# Altium schematic sheet 07cpu_sdcard.SchDoc
size B
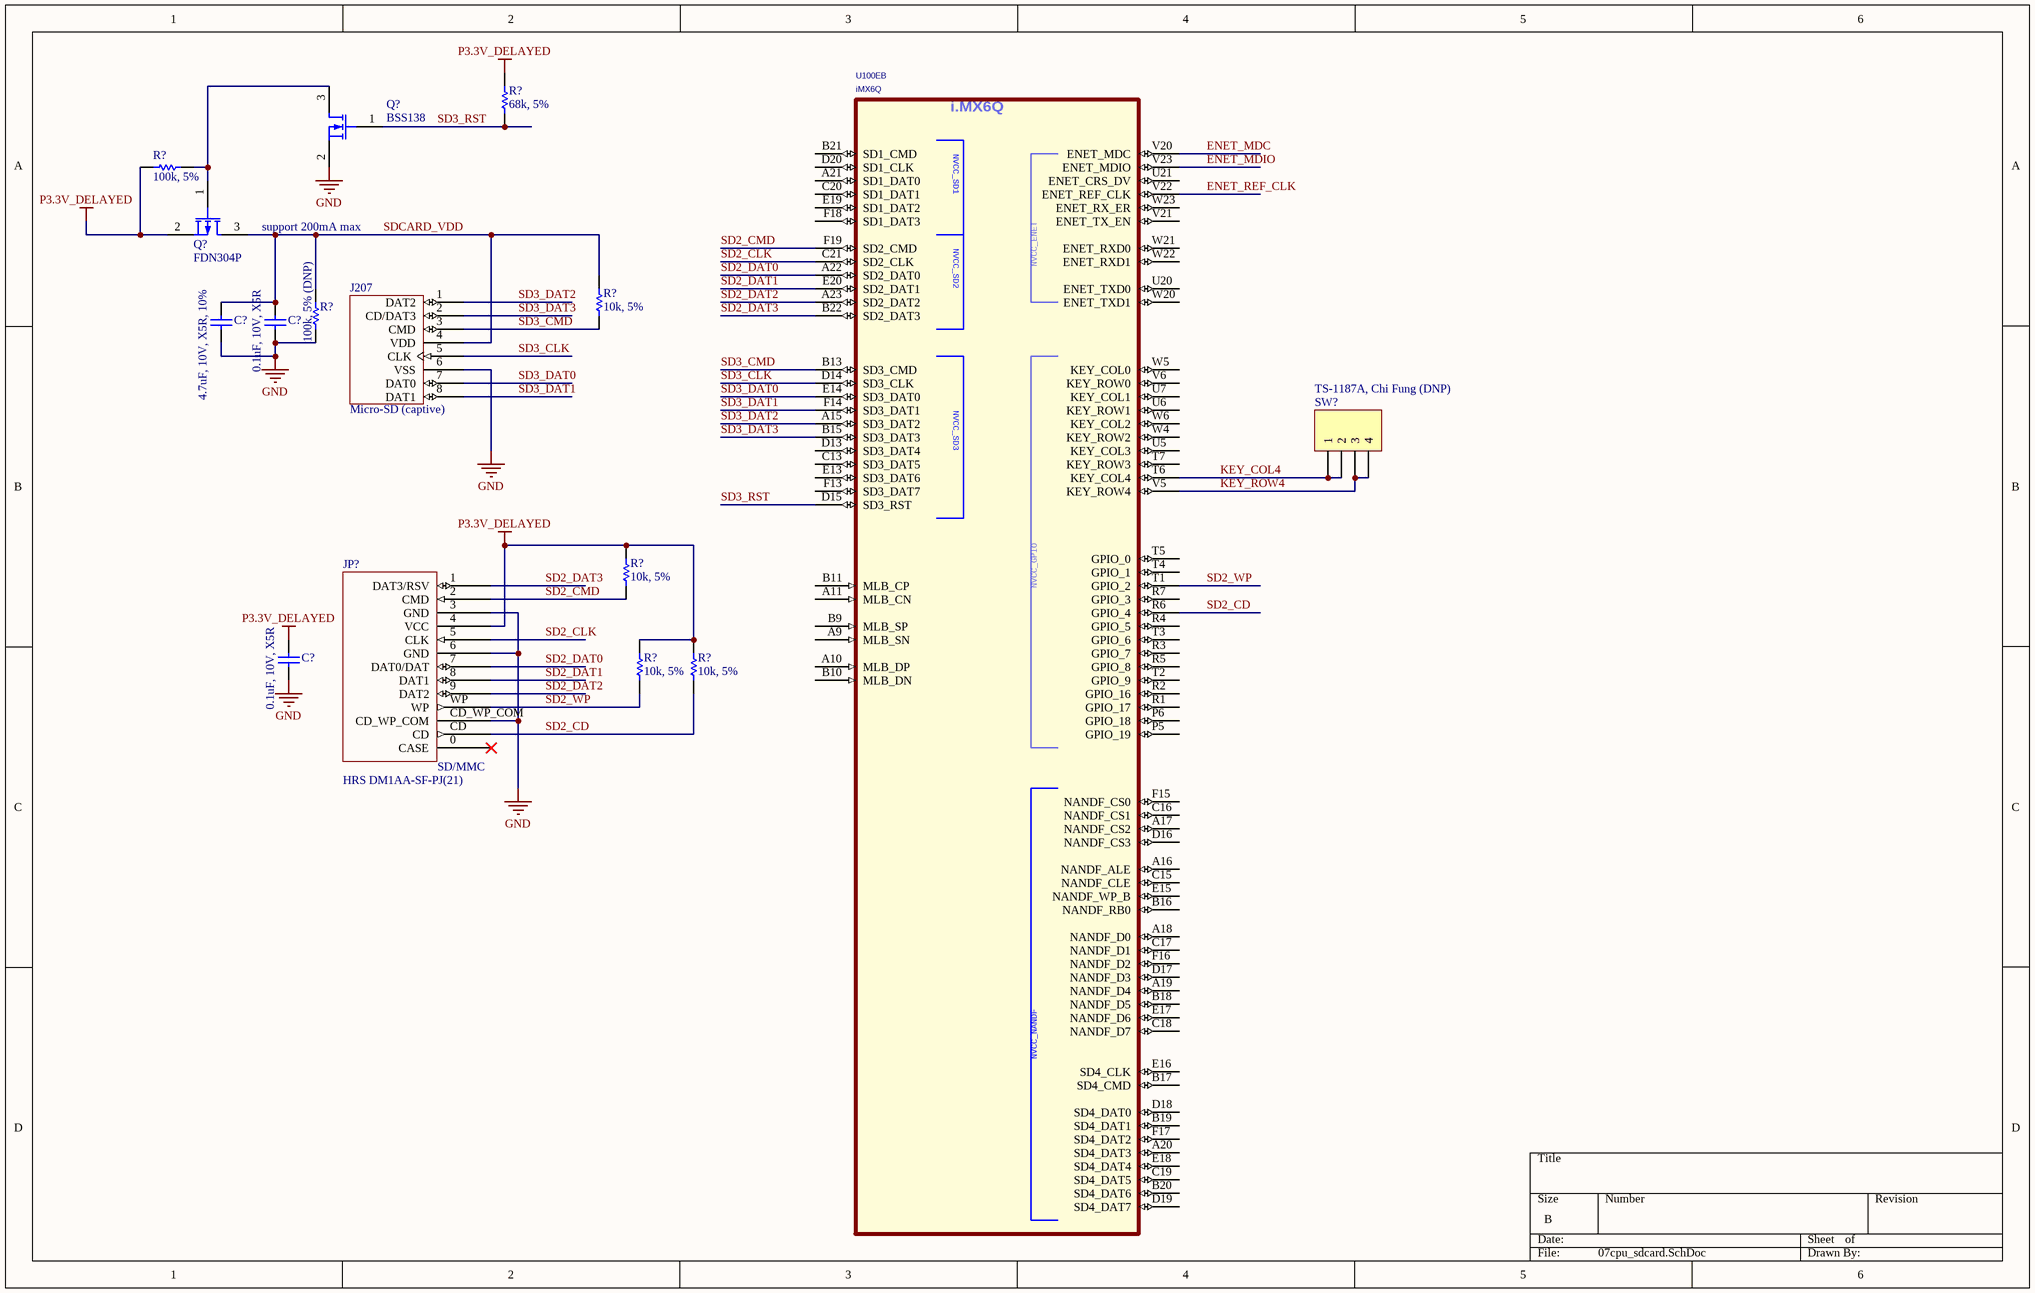
[diagram p0: 07cpu_sdcard.SchDoc]

## Parts
(Parts that share a designator on the sheet are numbered #1, #2 ... from top to bottom, then left to right.)
C?#1  4.7uF, 10V, X5R, 10%  [CAPC1608N]
C?#2  0.1uF, 10V, X5R  [CAPC1005N]
C?#3  0.1uF, 10V, X5R  [CAPC1005N]
J207  Micro-SD (captive)  [AUK_TFC08W01-HC-H]
JP?  HRS DM1AA-SF-PJ(21)  [HRS_DM1AA_SF_PEJ(21)]
Q?#1  BSS138  [SOT23-3N]
Q?#2  FDN304P  [SOT23-3N]
R?#1  68k, 5%  [RESC1005N]
R?#2  100k, 5%  [RESC1005N]
R?#3  10k, 5%  [RESC1005N]
R?#4  100k, 5% (DNP)  [RESC1005N]
R?#5  10k, 5%  [RESC1005N]
R?#6  10k, 5%  [RESC1005N]
R?#7  10k, 5%  [RESC1005N]
SW?  TS-1187A, Chi Fung (DNP)  [SWITCH_TS-1187A]
U100E  iMX6Q  [FREESCALE_BGA624C80P25X25_2100X2100X216]  (part B of 12)

## Nets
GND: C?#1.2 C?#2.2 C?#3.2 J207.6(VSS) JP?.3(GND) JP?.6(GND) JP?.CD_WP_COM Q?#1.2(S) R?#4.2
P3.3V_DELAYED: C?#3.1 JP?.4(VCC) Q?#2.2(S) R?#1.1 R?#2.2 R?#5.1 R?#6.1 R?#7.1
ENET_MDC: U100E.V20(ENET_MDC)
ENET_MDIO: U100E.V23(ENET_MDIO)
ENET_REF_CLK: U100E.V22(ENET_REF_CLK)
KEY_COL4: SW?.1 SW?.2 U100E.T6(KEY_COL4)
KEY_ROW4: SW?.3 SW?.4 U100E.V5(KEY_ROW4)
SD2_CD: JP?.CD R?#7.2 U100E.R6(GPIO_4)
SD2_CLK: JP?.5(CLK) U100E.C21(SD2_CLK)
SD2_CMD: JP?.2(CMD) R?#5.2 U100E.F19(SD2_CMD)
SD2_DAT0: JP?.7(DAT0/DAT) U100E.A22(SD2_DAT0)
SD2_DAT1: JP?.8(DAT1) U100E.E20(SD2_DAT1)
SD2_DAT2: JP?.9(DAT2) U100E.A23(SD2_DAT2)
SD2_DAT3: JP?.1(DAT3/RSV) U100E.B22(SD2_DAT3)
SD2_WP: JP?.WP R?#6.2 U100E.T1(GPIO_2)
SD3_CLK: J207.5(CLK) U100E.D14(SD3_CLK)
SD3_CMD: J207.3(CMD) R?#3.2 U100E.B13(SD3_CMD)
SD3_DAT0: J207.7(DAT0) U100E.E14(SD3_DAT0)
SD3_DAT1: J207.8(DAT1) U100E.F14(SD3_DAT1)
SD3_DAT2: J207.1(DAT2) U100E.A15(SD3_DAT2)
SD3_DAT3: J207.2(CD/DAT3) U100E.B15(SD3_DAT3)
SD3_RST: Q?#1.1(G) R?#1.2 U100E.D15(SD3_RST)
SDCARD_VDD: C?#1.1 C?#2.1 J207.4(VDD) Q?#2.3(D) R?#3.1 R?#4.1
NetQ?#1_3: Q?#1.3(D) Q?#2.1(G) R?#2.1

Not connected (* = marked no-connect by the designer): JP? 0(CASE)*; U100E A9(MLB_SN) A10(MLB_DP) A11(MLB_CN) A16(NANDF_ALE) A17(NANDF_CS2) A18(NANDF_D0) A19(NANDF_D4) A20(SD4_DAT3) A21(SD1_DAT0) B9(MLB_SP) B10(MLB_DN) B11(MLB_CP) B16(NANDF_RB0) B17(SD4_CMD) B18(NANDF_D5) B19(SD4_DAT1) B20(SD4_DAT6) B21(SD1_CMD) C13(SD3_DAT5) C15(NANDF_CLE) C16(NANDF_CS1) C17(NANDF_D1) C18(NANDF_D7) C19(SD4_DAT5) C20(SD1_DAT1) D13(SD3_DAT4) D16(NANDF_CS3) D17(NANDF_D3) D18(SD4_DAT0) D19(SD4_DAT7) D20(SD1_CLK) E13(SD3_DAT6) E15(NANDF_WP_B) E16(SD4_CLK) E17(NANDF_D6) E18(SD4_DAT4) E19(SD1_DAT2) F13(SD3_DAT7) F15(NANDF_CS0) F16(NANDF_D2) F17(SD4_DAT2) F18(SD1_DAT3) P5(GPIO_19) P6(GPIO_18) R1(GPIO_17) R2(GPIO_16) R3(GPIO_7) R4(GPIO_5) R5(GPIO_8) R7(GPIO_3) T2(GPIO_9) T3(GPIO_6) T4(GPIO_1) T5(GPIO_0) T7(KEY_ROW3) U5(KEY_COL3) U6(KEY_ROW1) U7(KEY_COL1) U20(ENET_TXD0) U21(ENET_CRS_DV) V6(KEY_ROW0) V21(ENET_TX_EN) W4(KEY_ROW2) W5(KEY_COL0) W6(KEY_COL2) W20(ENET_TXD1) W21(ENET_RXD0) W22(ENET_RXD1) W23(ENET_RX_ER)

## Notes on the sheet
- (near Q?#2) support 200mA max
- (in symbol HRS_DM1AA_SF_PEJ(21)) SD/MMC
- (in symbol PCIMX6Q6VV1A, part B) i.MX6Q

## Library data of the parts
C?#1-C?#3 = Cap Semi: Capacitor (Semiconductor SIM Model); Published: 8-Jun-2000; LatestRevisionDate: 17-Jul-2002; LatestRevisionNote: Re-released for DXP Platform.; PackageReference: C1206; Publisher: Altium Limited
J207 = MICRO_SD: Captive Micro-SD card for firmware images
JP? = HRS_DM1AA_SF_PEJ(21): SD card connector
Q?#1 = MOSFET-N: N-Channel MOSFET; Published: 8-Jun-2000; LatestRevisionDate: 17-Jul-2002; LatestRevisionNote: Re-released for DXP Platform.; PackageVersion: 1995/1996; PackageReference: E3; Publisher: Altium Limited
Q?#2 = MOSFET-P: P-Channel MOSFET; Published: 8-Jun-2000; LatestRevisionDate: 17-Jul-2002; LatestRevisionNote: Re-released for DXP Platform.; PackageVersion: 1995/1996; PackageReference: E3; Publisher: Altium Limited; PackageDescription: TO, Flat Index; 3 In-Line, Axial Leads; Body Dia. 4.6mm; Lead Dia. 0.5 mm (max)
R?#1 R?#3 R?#5-R?#7 = Res1: Resistor; Value: 100k; Published: 8-Jun-2000; LatestRevisionDate: 17-Jul-2002; LatestRevisionNote: Re-released for DXP Platform.; PackageReference: AXIAL-0.3; Publisher: Altium Limited
R?#2 R?#4 = Res1: Resistor; Published: 8-Jun-2000; LatestRevisionDate: 17-Jul-2002; LatestRevisionNote: Re-released for DXP Platform.; PackageReference: AXIAL-0.3; Publisher: Altium Limited; Value: 100k
SW? = Header 4: Chi Fung TS-1187A; LatestRevisionDate: 17-Jul-2002; LatestRevisionNote: Re-released for DXP Platform.; Publisher: Altium Limited
U100E = PCIMX6Q6VV1A: PLACEHOLDER FOR FREESCALE PART NUMBER PMCIMX6Q6VV1A.; AGILE_PN: TMP-WF-14526; MFG_NAME01: Freescale Semiconductor; PRE_APN: 344-01218; MFG_PN01: PCIMX6Q6VV1A; ROHS: Yes; HEIGHT: 2.16MM